# EAGLE design ShieldUSBHost (EAGLE 5.06)
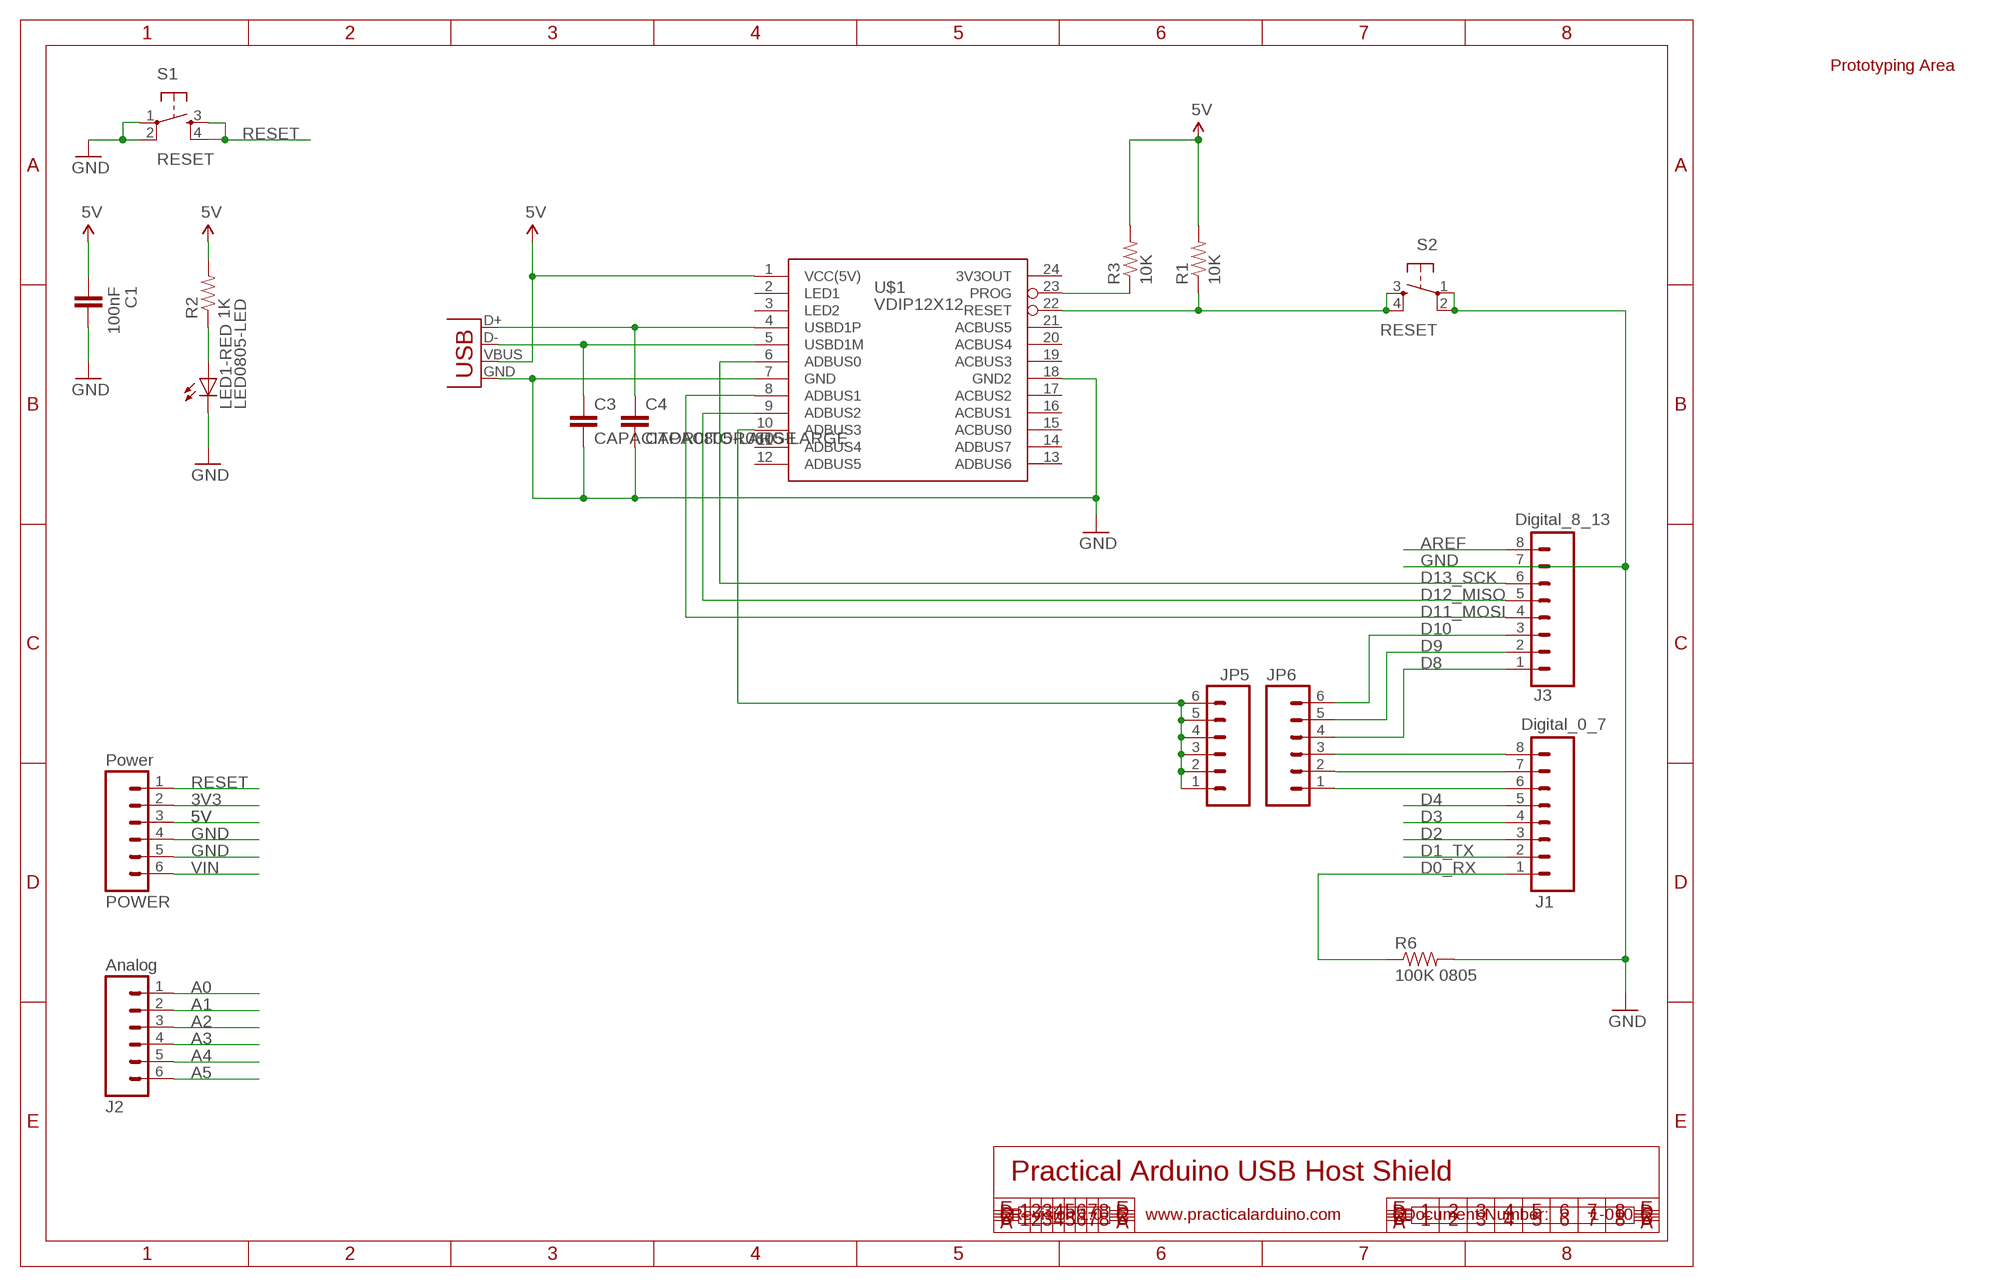
[diagram p0: schematic, sheet 1]

## Parts
C1  100nF  CAP0805-LARGE  [0805-LARGE]
C3  CAPACITOR0805-LARGE  [0805-LARGE]
C4  CAPACITOR0805-LARGE  [0805-LARGE]
J1  Digital_0_7  M08  [1X08]
J2  Analog  M06SIP  [1X06]
J3  Digital_8_13  M08  [1X08]
JP5  M06SIP  [1X06]
JP6  M06SIP  [1X06]
LED1-RED  LED0805-LED  [0805-LED]
POWER  Power  M06SIP  [1X06]
R1  10K  RESISTOR0805-LARGE  [0805-LARGE]
R2  1K  RESISTOR0805-LARGE  [0805-LARGE]
R3  10K  RESISTOR0805-LARGE  [0805-LARGE]
R6  100K 0805  RESISTOR0805-LARGE  [0805-LARGE]
S1  RESET  TAC_SWITCHPTH  [TACTILE-PTH]
S2  RESET  TAC_SWITCHPTH  [TACTILE-PTH]
U$1  VDIP12X12  [VDIP1-2X12]
X1  USB-A-S  [USB-A-S]

## Nets
3V3: POWER.2
5V: C1.1 POWER.3 R1.2 R2.2 R3.2 U$1.1(VCC(5V)) X1.VBUS
A0: J2.1
A1: J2.2
A2: J2.3
A3: J2.4
A4: J2.5
A5: J2.6
AREF: J3.8
D0_RX: J1.1 R6.1
D1_TX: J1.2
D2: J1.3
D3: J1.4
D4: J1.5
D8: J3.1 JP6.4
D9: J3.2 JP6.5
D10: J3.3 JP6.6
D11_MOSI: J3.4 U$1.8(ADBUS1)
D12_MISO: J3.5 U$1.9(ADBUS2)
D13_SCK: J3.6 U$1.6(ADBUS0)
GND: C1.2 C3.2 C4.2 J3.7 LED1-RED.2(C) POWER.4 POWER.5 R6.2 S1.1 S1.2 S2.1 S2.2 U$1.7(GND) U$1.18(GND2) X1.GND
N$1: R1.1 S2.3 S2.4 U$1.22(RESET)
N$5: J1.6 JP6.1
N$6: C4.1 U$1.4(USBD1P) X1.D+
N$7: J1.7 JP6.2
N$8: J1.8 JP6.3
N$89: LED1-RED.1(A) R2.1
N$134: C3.1 U$1.5(USBD1M) X1.D-
N$135: JP5.1 JP5.2 JP5.3 JP5.4 JP5.5 JP5.6 U$1.10(ADBUS3)
N$137: R3.1 U$1.23(PROG)
RESET: POWER.1 S1.3 S1.4
VIN: POWER.6
Unconnected: U$1.2(LED1) U$1.3(LED2) U$1.11(ADBUS4) U$1.12(ADBUS5) U$1.13(ADBUS6) U$1.14(ADBUS7) U$1.15(ACBUS0) U$1.16(ACBUS1) U$1.17(ACBUS2) U$1.19(ACBUS3) U$1.20(ACBUS4) U$1.21(ACBUS5)

## Notes on the sheet
- Prototyping Area
- Practical Arduino USB Host Shield
- Revision 1.0 | www.practicalarduino.com | Document Number: | 1-010

## Power pins joined to a net without a drawn wire
3V3OUT: U$1.24(3V3OUT)

## Library data of the parts
C1 = SparkFun:CAP: Capacitor Standard 0603 ceramic capacitor, and 0.1" leaded capacitor.
C3 C4 = PracticalArduino:CAPACITOR: Non-polarised capacitor on oversized 0805 pads
J1 J3 = SparkFun:M08: Header 8 Standard 8-pin 0.1" header. Use with straight break away headers (SKU : PRT-00116), right angle break away headers (PRT-00553), swiss pins (PRT-00743), machine pins (PRT-00117), and female headers (PRT-00115).
J2 JP5 JP6 POWER = SparkFun:M06: Header 6 Standard 6-pin 0.1" header. Use with straight break away headers (SKU : PRT-00116), right angle break away headers (PRT-00553), swiss pins (PRT-00743), machine pins (PRT-00117), and female headers (PRT-00115). Molex polarized connector foot print use with SKU : PRT-08094 with associated crimp pins and housings. NOTES ON THE VARIANTS LOCK and LOCK_LONGPADS... This footprint was designed to help hold the alignment of a through-hole component (i.e. 6-pin header) while soldering it into place. You may notice that each hole has been shifted either up or down by 0.005 of an inch from it's more standard position (which is a perfectly straight line). This slight alteration caused the pins (the squares in the middle) to touch the edges of the holes. Because they are alternating, it causes a "brace" to hold the component in place. 0.005 has proven to be the perfect amount of "off-center" position when using our standard breakaway headers. Although looks a little odd when you look at the bare footprint, once you have a header in there, the alteration is very hard to notice. Also, if you push a header all the way into place, it is covered up entirely on the bottom side. This idea of altering the position of holes to aid alignment will be further integrated into the Sparkfun Library for other footprints. It can help hold any component with 3 or more connection pins.
LED1-RED = PracticalArduino:LED
R1-R3 R6 = SparkFun:RESISTOR: Resistor Basic schematic elements and footprints for 0603, 1206, and PTH 1/10th watt (small) resistors.
S1 S2 = SparkFun:TAC_SWITCH: Momentary Switch Button commonly used for reset or general input. Spark Fun Electronics SKU : COM-00097
U$1 = PracticalArduino:VDIP1
X1 = SparkFun:USB: USB Connectors USB-B-PTH is fully proven SKU : PRT-00139 USB-miniB is fully proven SKU : PRT-00587 USB-A-PCB is untested. USB-A-H is throughly reviewed, but untested. Spark Fun Electronics SKU : PRT-00437 USB-B-SMT is throughly reviewed, but untested. Needs silkscreen touching up. USB-A-S has not been used/tested USB-MB-H has not been used/tested

## Board
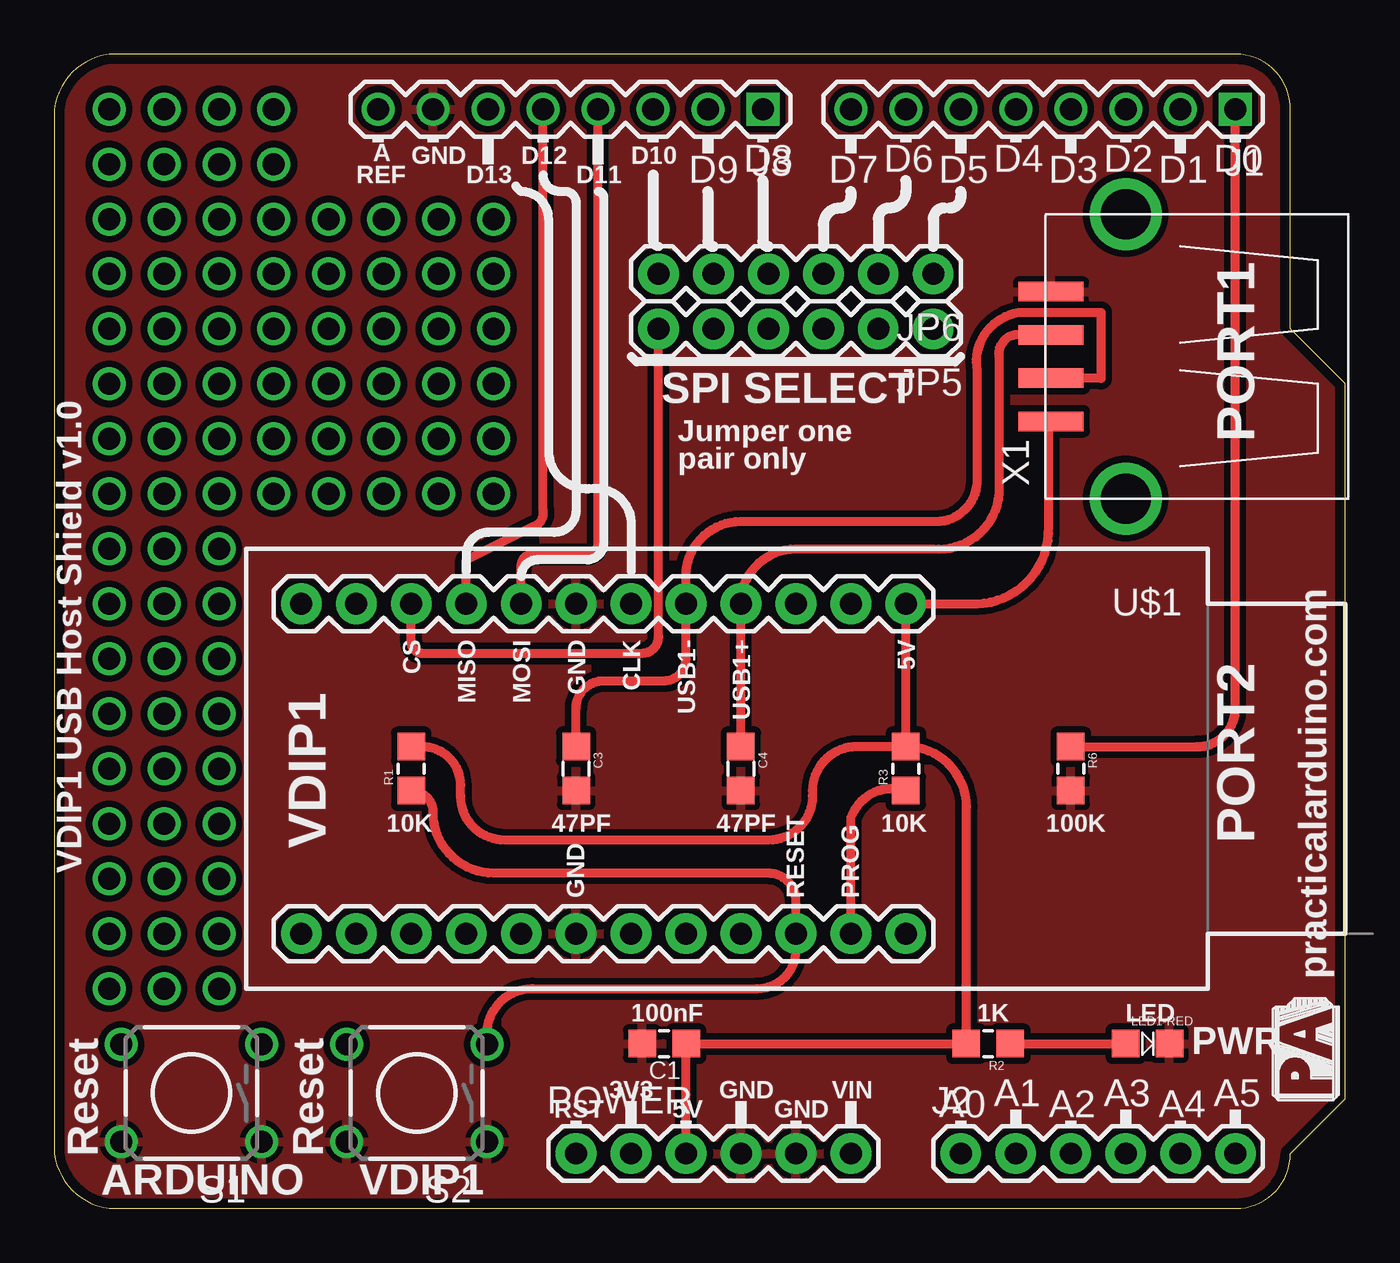
[diagram p1: board, top side]
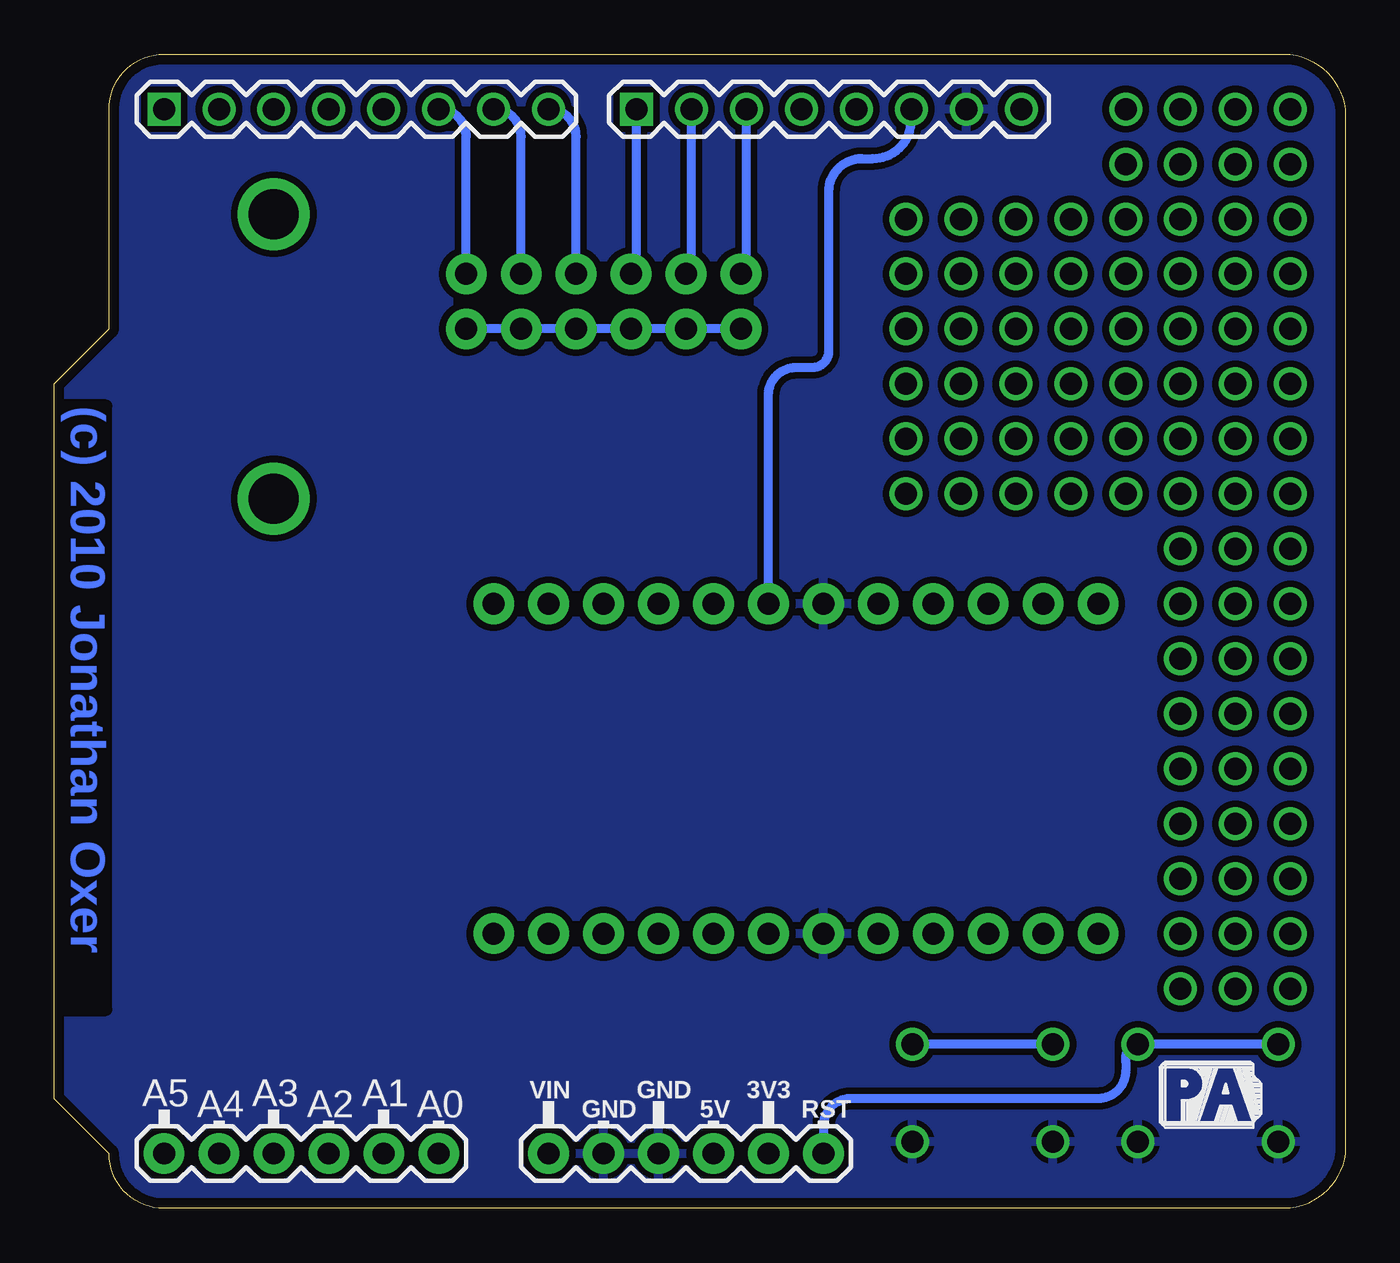
[diagram p2: board, bottom side, seen from below]

Size 59.69 x 53.34 mm. Coordinates in mm from the lower left corner, seen from the top.
Outline: 0,2.54 arc74 2.54,0 54.61,0 arc90 57.15,2.54 59.69,5.08 59.69,38.1 57.15,40.64 57.15,50.8 arc90 54.61,53.34 2.54,53.34 arc74 0,50.8 0,2.54
Copper layers (1*16): Top 0.035mm / dielectric 1.5mm / Bottom 0.035mm
Design rules "default *": minimum track width 10mil, minimum drill 24mil, track to track 12mil, track to pad 12mil, pad to pad 12mil, via to via 12mil, smd to smd 8mil, copper to edge 18mil, drill to drill 8mil, minimum pad ring 10mil, minimum via ring 8mil, stop-mask expansion 4mil, vias tented up to drill 0mil, thermal gap 10mil

### Footprints (pad centres in the part's own frame; a part is rotated, then mirrored left to right if it is on the bottom)
0805-LARGE = smd 1.27 x 1.27: 1 -1.016,0; 2 1.016,0
1X08 = drill 1.016 square: 1 0,0 | drill 1.016 round: 2 2.54,0; 3 5.08,0; 4 7.62,0; 5 10.16,0; 6 12.7,0; 7 15.24,0; 8 17.78,0
1X06 = drill 1.016 pad 1.88 round: 1 0,0; 2 2.54,0; 3 5.08,0; 4 7.62,0; 5 10.16,0; 6 12.7,0
0805-LED = smd 1.27 x 1.27: 1 -1.016,0; 2 1.016,0
TACTILE-PTH = drill 1.016 round: 1 -3.251,2.261; 2 3.251,2.261; 3 -3.251,-2.261; 4 3.251,-2.261
VDIP1-2X12 = drill 1.016 pad 1.88 round: 1 -13.97,-7.62; 2 -11.43,-7.62; 3 -8.89,-7.62; 4 -6.35,-7.62; 5 -3.81,-7.62; 6 -1.27,-7.62; 7 1.27,-7.62; 8 3.81,-7.62; 9 6.35,-7.62; 10 8.89,-7.62; 11 11.43,-7.62; 12 13.97,-7.62; 13 13.97,7.62; 14 11.43,7.62; 15 8.89,7.62; 16 6.35,7.62; 17 3.81,7.62; 18 1.27,7.62; 19 -1.27,7.62; 20 -3.81,7.62; 21 -6.35,7.62; 22 -8.89,7.62; 23 -11.43,7.62; 24 -13.97,7.62
USB-A-S = smd 3 x 0.9: D+ 3.45,-1; D- 3.45,1; GND 3.45,-3; VBUS 3.45,3 | drill 2.311 round: P$5 0,-6.566; P$6 0,6.566

### Placement (x,y rotation side)
C1  28.19,7.62 180 top
C3  24.13,20.32 270 top
C4  31.75,20.32 270 top
J1  54.61,50.8 180 top
J2  41.91,2.54 0 top
J3  32.77,50.8 180 top
JP5  40.64,40.64 180 top
JP6  40.64,43.18 180 top
LED1-RED  50.55,7.62 0 top
POWER  24.13,2.54 0 top
R1  16.51,20.32 90 top
R2  43.18,7.62 180 top
R3  39.37,20.32 90 top
R6  46.99,20.32 270 top
S1  6.35,5.33 180 top
S2  16.76,5.33 180 top
U$1  25.4,20.32 180 top
U$4  [PRACTICALARDUINO-LOGO]  59.39,5 90 top
U$5  [PRACTICALARDUINO-LOGO]  8.59,3.73 0 bottom
X1  49.53,39.37 180 top

### Tracks (layer width: path | path; a pad name or v marks a point on that pad's centre or on a via)
5V
  Top 0.406: X1.VBUS arc90 45.97,36.26 45.97,31.5 arc-90 42.67,27.94 U$1.1 R3.2 | R1.2 17.02,21.34 arc-90 18.8,19.56 18.8,19.05 arc90 20.83,17.02 33.02,17.02 arc90 35.05,19.05 35.05,19.3 arc-90 37.08,21.34 R3.2 | R3.2 39.62,21.34 arc-90 42.16,18.29 R2.2 C1.1 POWER.3
D0_RX
  Top 0.406: J1.1 54.61,23.11 arc-90 52.83,21.34 R6.1
D8
  Bottom 0.406: J3.1 32.77,43.43 arc90 JP6.4
D9
  Bottom 0.406: J3.2 30.23,43.43 arc90 JP6.5
D10
  Bottom 0.406: J3.3 27.69,43.43 arc90 JP6.6
D11_MOSI
  Top 0.406: J3.4 25.15,30.73 arc-90 24.64,30.23 22.1,30.23 arc90 21.59,29.72 U$1.8
D12_MISO
  Top 0.406: J3.5 22.61,32.26 arc-90 22.1,31.5 19.05,29.97 U$1.9
D13_SCK
  Bottom 0.406: U$1.6 26.67,37.59 arc90 25.4,38.86 24.64,38.86 arc-90 23.88,39.62 23.88,46.99 arc90 22.35,48.51 21.84,48.51 arc-90 20.07,50.29 J3.6
GND
  pour Bottom: 0,50.8 arc-74 2.54,53.34 54.61,53.34 arc-74 57.15,50.8 57.15,40.64 59.69,38.1 59.69,5.08 57.15,2.54 arc-74 54.61,0 2.54,0 arc-74 0,2.54
  pour Top: 0,50.8 arc-74 2.54,53.34 54.61,53.34 arc-74 57.15,50.8 57.15,40.64 59.69,38.1 59.69,5.08 57.15,2.54 arc-74 54.61,0 2.54,0 arc-74 0,2.54
N$1
  Top 0.406: R1.1 arc-90 17.53,18.29 arc90 20.32,15.49 33.02,15.49 arc-90 34.29,14.22 U$1.22 34.29,11.94 arc-90 32.51,10.16 22.1,10.16 arc90 20.02,8.08 S2.3
  Bottom 0.406: S2.4 S2.3
N$2  (via drill 1.02 pad 1.52)
  other vias: 7.62,50.8
N$3  (via drill 1.02 pad 1.52)
  other vias: 17.78,38.1
N$4  (via drill 1.02 pad 1.52)
  other vias: 10.16,35.56
N$5
  Bottom 0.406: J1.6 arc90 40.64,49.53 JP6.1
N$6
  Top 0.406: C4.1 U$1.4 arc-90 34.29,30.48 40.64,30.48 arc90 43.69,33.02 43.69,39.37 arc-90 44.45,40.39 45.81,40.39 arc-90 X1.D+
N$7
  Bottom 0.406: J1.7 arc90 38.1,49.53 JP6.2
N$8
  Bottom 0.406: J1.8 arc90 35.56,49.53 JP6.3
N$9  (via drill 1.02 pad 1.52)
  other vias: 5.08,27.94
N$10  (via drill 1.02 pad 1.52)
  other vias: 7.62,22.86
N$11  (via drill 1.02 pad 1.52)
  other vias: 5.08,15.24
N$12  (via drill 1.02 pad 1.52)
  other vias: 7.62,38.1
N$13  (via drill 1.02 pad 1.52)
  other vias: 10.16,38.1
N$14  (via drill 1.02 pad 1.52)
  other vias: 12.7,38.1
N$15  (via drill 1.02 pad 1.52)
  other vias: 5.08,38.1
N$16  (via drill 1.02 pad 1.52)
  other vias: 10.16,40.64
N$17  (via drill 1.02 pad 1.52)
  other vias: 7.62,40.64
N$18  (via drill 1.02 pad 1.52)
  other vias: 2.54,40.64
N$19  (via drill 1.02 pad 1.52)
  other vias: 5.08,40.64
N$20  (via drill 1.02 pad 1.52)
  other vias: 2.54,38.1
N$21  (via drill 1.02 pad 1.52)
  other vias: 12.7,40.64
N$22  (via drill 1.02 pad 1.52)
  other vias: 15.24,40.64
N$23  (via drill 1.02 pad 1.52)
  other vias: 17.78,40.64
N$24  (via drill 1.02 pad 1.52)
  other vias: 20.32,40.64
N$25  (via drill 1.02 pad 1.52)
  other vias: 20.32,38.1
N$26  (via drill 1.02 pad 1.52)
  other vias: 15.24,38.1
N$27  (via drill 1.02 pad 1.52)
  other vias: 20.32,35.56
N$28  (via drill 1.02 pad 1.52)
  other vias: 17.78,35.56
N$29  (via drill 1.02 pad 1.52)
  other vias: 20.32,33.02
N$30  (via drill 1.02 pad 1.52)
  other vias: 17.78,33.02
N$31  (via drill 1.02 pad 1.52)
  other vias: 15.24,33.02
N$32  (via drill 1.02 pad 1.52)
  other vias: 15.24,35.56
N$33  (via drill 1.02 pad 1.52)
  other vias: 12.7,33.02
N$34  (via drill 1.02 pad 1.52)
  other vias: 12.7,35.56
N$35  (via drill 1.02 pad 1.52)
  other vias: 10.16,33.02
N$36  (via drill 1.02 pad 1.52)
  other vias: 7.62,33.02
N$37  (via drill 1.02 pad 1.52)
  other vias: 5.08,33.02
N$38  (via drill 1.02 pad 1.52)
  other vias: 2.54,33.02
N$39  (via drill 1.02 pad 1.52)
  other vias: 2.54,35.56
N$40  (via drill 1.02 pad 1.52)
  other vias: 5.08,35.56
N$41  (via drill 1.02 pad 1.52)
  other vias: 7.62,35.56
N$42  (via drill 1.02 pad 1.52)
  other vias: 20.32,43.18
N$43  (via drill 1.02 pad 1.52)
  other vias: 20.32,45.72
N$44  (via drill 1.02 pad 1.52)
  other vias: 17.78,43.18
N$45  (via drill 1.02 pad 1.52)
  other vias: 17.78,45.72
N$46  (via drill 1.02 pad 1.52)
  other vias: 15.24,43.18
N$47  (via drill 1.02 pad 1.52)
  other vias: 15.24,45.72
N$48  (via drill 1.02 pad 1.52)
  other vias: 12.7,43.18
N$49  (via drill 1.02 pad 1.52)
  other vias: 12.7,45.72
N$50  (via drill 1.02 pad 1.52)
  other vias: 10.16,43.18
N$51  (via drill 1.02 pad 1.52)
  other vias: 5.08,45.72
N$52  (via drill 1.02 pad 1.52)
  other vias: 10.16,48.26
N$53  (via drill 1.02 pad 1.52)
  other vias: 10.16,50.8
N$54  (via drill 1.02 pad 1.52)
  other vias: 7.62,48.26
N$55  (via drill 1.02 pad 1.52)
  other vias: 10.16,45.72
N$56  (via drill 1.02 pad 1.52)
  other vias: 7.62,43.18
N$57  (via drill 1.02 pad 1.52)
  other vias: 7.62,45.72
N$58  (via drill 1.02 pad 1.52)
  other vias: 5.08,43.18
N$59  (via drill 1.02 pad 1.52)
  other vias: 2.54,45.72
N$60  (via drill 1.02 pad 1.52)
  other vias: 2.54,43.18
N$61  (via drill 1.02 pad 1.52)
  other vias: 2.54,48.26
N$62  (via drill 1.02 pad 1.52)
  other vias: 2.54,50.8
N$63  (via drill 1.02 pad 1.52)
  other vias: 5.08,48.26
N$64  (via drill 1.02 pad 1.52)
  other vias: 5.08,50.8
N$65  (via drill 1.02 pad 1.52)
  other vias: 2.54,30.48
N$66  (via drill 1.02 pad 1.52)
  other vias: 5.08,30.48
N$67  (via drill 1.02 pad 1.52)
  other vias: 7.62,30.48
N$68  (via drill 1.02 pad 1.52)
  other vias: 7.62,27.94
N$69  (via drill 1.02 pad 1.52)
  other vias: 7.62,25.4
N$70  (via drill 1.02 pad 1.52)
  other vias: 5.08,25.4
N$71  (via drill 1.02 pad 1.52)
  other vias: 2.54,27.94
N$72  (via drill 1.02 pad 1.52)
  other vias: 2.54,25.4
N$73  (via drill 1.02 pad 1.52)
  other vias: 2.54,22.86
N$74  (via drill 1.02 pad 1.52)
  other vias: 5.08,20.32
N$75  (via drill 1.02 pad 1.52)
  other vias: 5.08,22.86
N$76  (via drill 1.02 pad 1.52)
  other vias: 7.62,20.32
N$77  (via drill 1.02 pad 1.52)
  other vias: 2.54,20.32
N$78  (via drill 1.02 pad 1.52)
  other vias: 2.54,17.78
N$79  (via drill 1.02 pad 1.52)
  other vias: 7.62,12.7
N$80  (via drill 1.02 pad 1.52)
  other vias: 5.08,17.78
N$81  (via drill 1.02 pad 1.52)
  other vias: 7.62,17.78
N$82  (via drill 1.02 pad 1.52)
  other vias: 7.62,15.24
N$83  (via drill 1.02 pad 1.52)
  other vias: 5.08,12.7
N$84  (via drill 1.02 pad 1.52)
  other vias: 2.54,12.7
N$85  (via drill 1.02 pad 1.52)
  other vias: 2.54,15.24
N$86  (via drill 1.02 pad 1.52)
  other vias: 2.54,10.16
N$87  (via drill 1.02 pad 1.52)
  other vias: 5.08,10.16
N$88  (via drill 1.02 pad 1.52)
  other vias: 7.62,10.16
N$89
  Top 0.406: R2.1 LED1-RED.1
N$134
  Top 0.406: X1.D- 47.11,38.35 48.39,38.35 48.39,41.4 44.58,41.4 arc90 42.67,38.73 42.67,33.53 arc-90 40.64,31.75 31.75,31.75 arc90 29.21,29.21 U$1.5 29.21,25.4 arc-90 28.19,24.38 25.4,24.38 arc90 24.13,23.11 C3.1
N$135
  Top 0.406: JP5.6 27.94,26.42 arc-90 27.18,25.65 17.02,25.65 arc-90 16.51,26.16 U$1.10
  Bottom 0.406: JP5.6 JP5.5 JP5.4 JP5.3 JP5.2 JP5.1
N$137
  Top 0.406: R3.1 arc90 36.83,18.03 U$1.23
RESET
  Bottom 0.406: S1.4 S1.3 arc-90 10.16,6.78 10.16,6.35 arc90 11.43,5.08 22.86,5.08 arc-90 24.13,3.81 POWER.1

### Text on the board
Bottom: (c) 2010 Jonathan Oxer
tPlace: A | GND | D12 | D10 | D8 | D6 | D4 | D2 | D0 | REF | D13 | D11 | D9 | D7 | D5 | D3 | D1 | SPI SELECT | Jumper one | PORT1 | pair only | CS | MISO | MOSI | GND | CLK | USB1- | USB1+ | 5V | VDIP1 | 10K | 47PF | 47PF | 10K | 100K | PORT2 | VDIP1 USB Host Shield v1.0 | GND | RESET | PROG | practicalarduino.com | 100nF | 1K | LED | PWR | 3V3 | GND | VIN | A1 | A3 | A5 | RST | 5V | GND | A0 | A2 | A4 | Reset | Reset | ARDUINO | VDIP1
bPlace: 3V3 | GND | VIN | A1 | A3 | A5 | RST | 5V | GND | A0 | A2 | A4